# Altium schematic sheet FPGA_MEMORIES.SchDoc: Pin Swapping
size 431 x 279 mm; DocumentNumber: 5; SheetNumber: 5; SheetTotal: 5
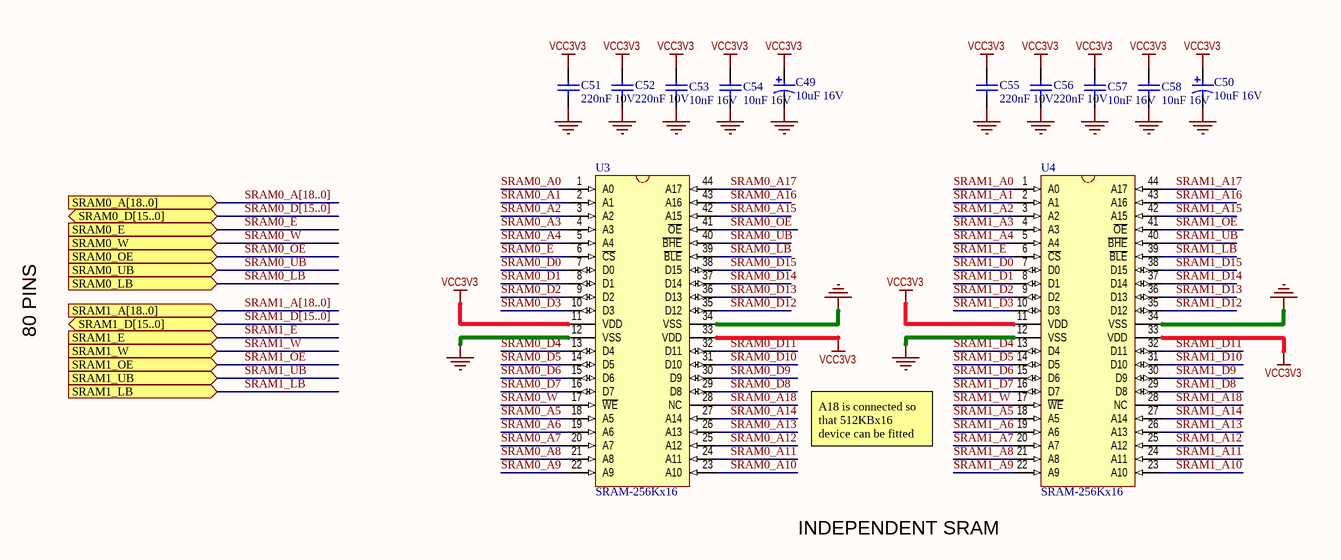
[diagram p0: FPGA_MEMORIES.SchDoc]

## Parts
C49  10uF 16V  [CAPC3528]
C50  10uF 16V  [CAPC3528]
C51  220nF 10V  [CAPC1608]
C52  220nF 10V  [CAPC1608]
C53  10nF 16V  [CAPC1005]
C54  10nF 16V  [CAPC1005]
C55  220nF 10V  [CAPC1608]
C56  220nF 10V  [CAPC1608]
C57  10nF 16V  [CAPC1005]
C58  10nF 16V  [CAPC1005]
U3  SRAM-256Kx16  [TSOP80P1176-44]
U4  SRAM-256Kx16  [TSOP80P1176-44]

## Ports
SRAM0_A[18..0] (in), SRAM0_D[15..0] (bidir), SRAM0_E (in), SRAM0_LB (in), SRAM0_OE (in), SRAM0_UB (in), SRAM0_W (in), SRAM1_A[18..0] (in), SRAM1_D[15..0] (bidir), SRAM1_E (in), SRAM1_LB (in), SRAM1_OE (in), SRAM1_UB (in), SRAM1_W (in)

## Nets
GND: C49.2 C50.2 C51.2 C52.2 C53.2 C54.2 C55.2 C56.2 C57.2 C58.2 U3.12(VSS) U3.34(VSS) U4.12(VSS) U4.34(VSS)
VCC3V3: C49.1 C50.1 C51.1 C52.1 C53.1 C54.1 C55.1 C56.1 C57.1 C58.1 U3.11(VDD) U3.33(VDD) U4.11(VDD) U4.33(VDD)
SRAM0_A0: U3.1(A0)
SRAM0_A1: U3.2(A1)
SRAM0_A2: U3.3(A2)
SRAM0_A3: U3.4(A3)
SRAM0_A4: U3.5(A4)
SRAM0_A5: U3.18(A5)
SRAM0_A6: U3.19(A6)
SRAM0_A7: U3.20(A7)
SRAM0_A8: U3.21(A8)
SRAM0_A9: U3.22(A9)
SRAM0_A10: U3.23(A10)
SRAM0_A11: U3.24(A11)
SRAM0_A12: U3.25(A12)
SRAM0_A13: U3.26(A13)
SRAM0_A14: U3.27(A14)
SRAM0_A15: U3.42(A15)
SRAM0_A16: U3.43(A16)
SRAM0_A17: U3.44(A17)
SRAM0_A18: U3.28(NC)
SRAM0_D0: U3.7(D0)
SRAM0_D1: U3.8(D1)
SRAM0_D2: U3.9(D2)
SRAM0_D3: U3.10(D3)
SRAM0_D4: U3.13(D4)
SRAM0_D5: U3.14(D5)
SRAM0_D6: U3.15(D6)
SRAM0_D7: U3.16(D7)
SRAM0_D8: U3.29(D8)
SRAM0_D9: U3.30(D9)
SRAM0_D10: U3.31(D10)
SRAM0_D11: U3.32(D11)
SRAM0_D12: U3.35(D12)
SRAM0_D13: U3.36(D13)
SRAM0_D14: U3.37(D14)
SRAM0_D15: U3.38(D15)
SRAM0_E: U3.6(~{CS}) ; port SRAM0_E
SRAM0_LB: U3.39(~{BLE}) ; port SRAM0_LB
SRAM0_OE: U3.41(~{OE}) ; port SRAM0_OE
SRAM0_UB: U3.40(~{BHE}) ; port SRAM0_UB
SRAM0_W: U3.17(~{WE}) ; port SRAM0_W
SRAM1_A0: U4.1(A0)
SRAM1_A1: U4.2(A1)
SRAM1_A2: U4.3(A2)
SRAM1_A3: U4.4(A3)
SRAM1_A4: U4.5(A4)
SRAM1_A5: U4.18(A5)
SRAM1_A6: U4.19(A6)
SRAM1_A7: U4.20(A7)
SRAM1_A8: U4.21(A8)
SRAM1_A9: U4.22(A9)
SRAM1_A10: U4.23(A10)
SRAM1_A11: U4.24(A11)
SRAM1_A12: U4.25(A12)
SRAM1_A13: U4.26(A13)
SRAM1_A14: U4.27(A14)
SRAM1_A15: U4.42(A15)
SRAM1_A16: U4.43(A16)
SRAM1_A17: U4.44(A17)
SRAM1_A18: U4.28(NC)
SRAM1_D0: U4.7(D0)
SRAM1_D1: U4.8(D1)
SRAM1_D2: U4.9(D2)
SRAM1_D3: U4.10(D3)
SRAM1_D4: U4.13(D4)
SRAM1_D5: U4.14(D5)
SRAM1_D6: U4.15(D6)
SRAM1_D7: U4.16(D7)
SRAM1_D8: U4.29(D8)
SRAM1_D9: U4.30(D9)
SRAM1_D10: U4.31(D10)
SRAM1_D11: U4.32(D11)
SRAM1_D12: U4.35(D12)
SRAM1_D13: U4.36(D13)
SRAM1_D14: U4.37(D14)
SRAM1_D15: U4.38(D15)
SRAM1_E: U4.6(~{CS}) ; port SRAM1_E
SRAM1_LB: U4.39(~{BLE}) ; port SRAM1_LB
SRAM1_OE: U4.41(~{OE}) ; port SRAM1_OE
SRAM1_UB: U4.40(~{BHE}) ; port SRAM1_UB
SRAM1_W: U4.17(~{WE}) ; port SRAM1_W

## Buses and harness runs
bus SRAM0_A[18..0] = port SRAM0_A[18..0]
bus SRAM0_D[15..0] = port SRAM0_D[15..0]
bus SRAM1_A[18..0] = port SRAM1_A[18..0]
bus SRAM1_D[15..0] = port SRAM1_D[15..0]

## Notes on the sheet
- 80 PINS
- A18 is connected so that 512KBx16 device can be fitted
- INDEPENDENT SRAM
- 8
- 7
- 6
- 5
- 4
- 3
- DWG. NO.
- REV.
- SHT.
- 2
- 1
- THIS DOCUMENT AND THE DATA DISCLOSED HEREIN OR HEREWITH IS THE PROPERTY OF ALTIUM LIMITED AND MAY BE FREELY DISTRIBUTED IN WHOLE. NO RIGHTS ARE RESERVED OR EXPRESS OR IMPLIED WARANTEE GIVEN.
- REVISION
- DESCRIPTION
- DATE
- APPROVED
- F
- E
- D
- C
- B
- A
- TITLE
- SCALE:
- SIZE
- CAGE CODE
- FILE NAME
- DWG NO.
- SHEET
- OF
- REV

## Library data of the parts
C49 C50 = CAP-P: Polar Capacitor; Design Item Id: CAP-P-10uF-16V-MCCT-B
C51-C58 = CAP-NP: Capacitor
  C51 C52 C55 C56: Design Item Id: CAP-NP-220nF-10V-0603
  C53 C54 C57 C58: Design Item Id: CAP-NP-10nF-16V-0402
U3 U4 = K6R4016V1D-T: 256Kx16Bit SRAM TSOP44; Design Item Id: MEM-SRAM-256Kx16-TSOP44